# Altium schematic sheet PainRegister.SchDoc: Название платы
size 840 x 594 mm; ApprovedBy: Рогов; CheckedBy: Фамилия проверяющего; DrawnBy: Фамилия разработчика; DocumentNumber: Введите номер платы + Э3; SheetNumber: пусто если лист 1, иначе 1; SheetTotal: количество листов; Title1str: (вторая строка при необходимости); DocumentType: тип схемы; Format: A1; ImagePath: Введите номер платы
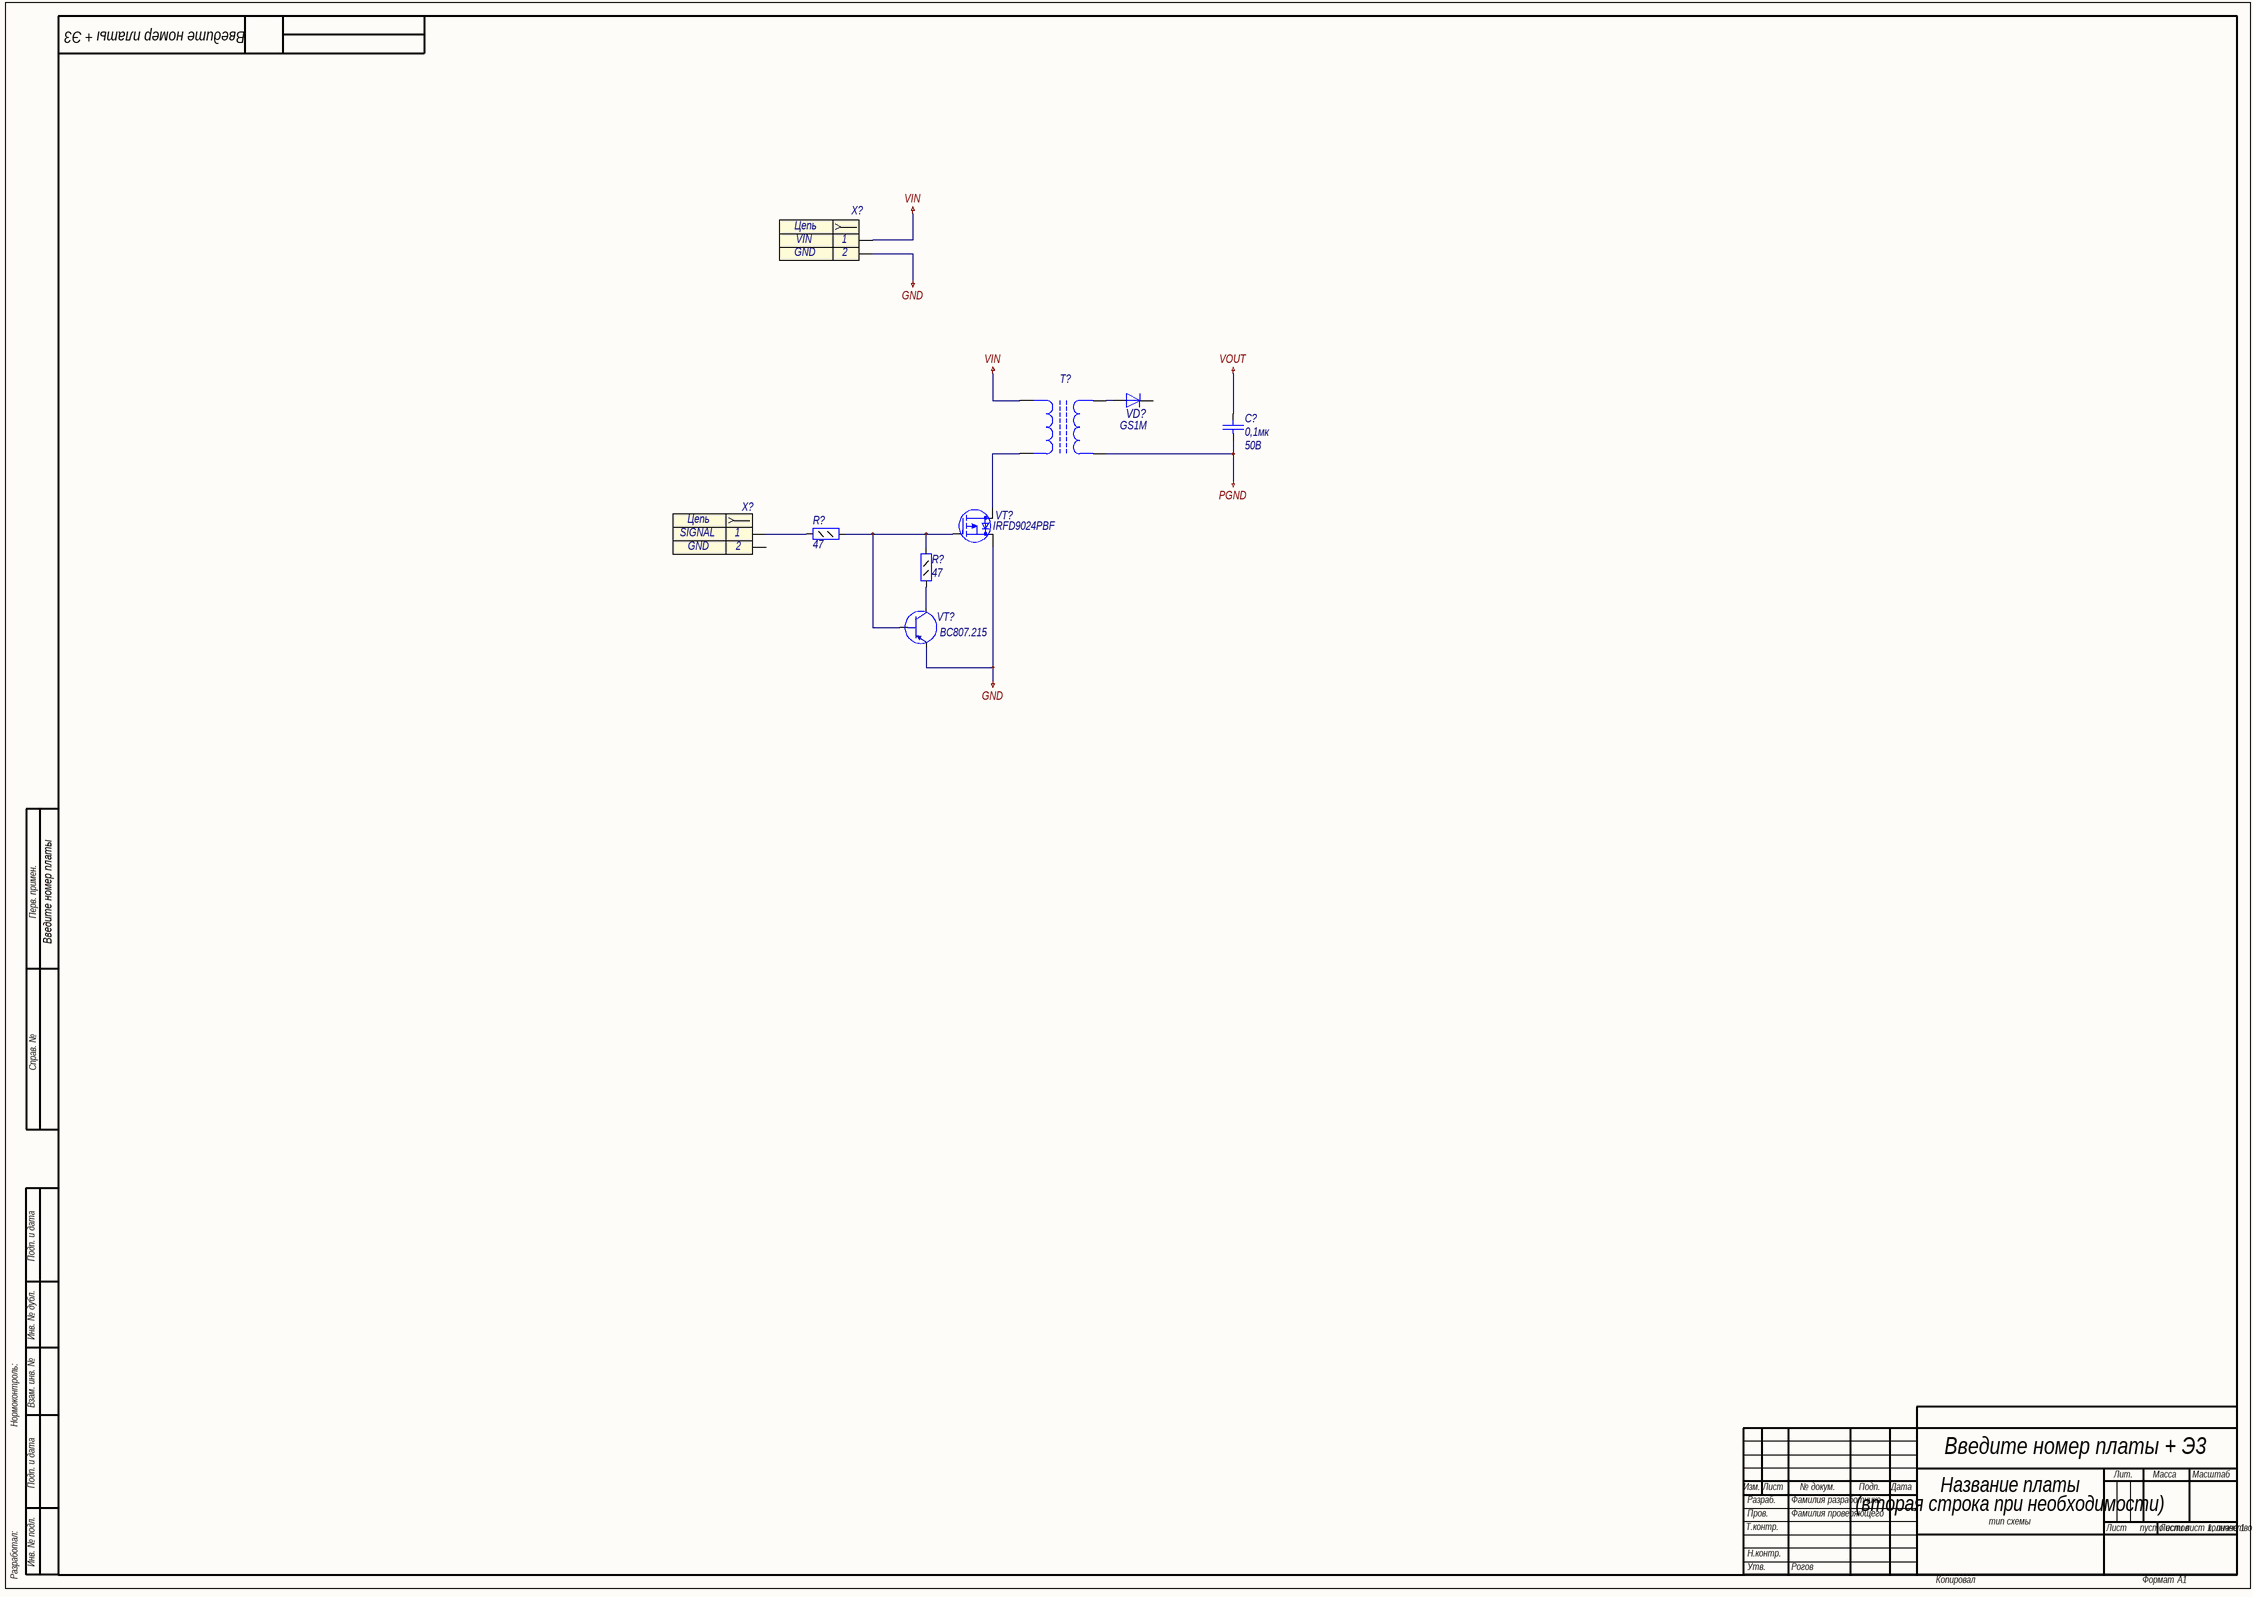
[diagram p0: PainRegister.SchDoc]

## Parts
(Parts that share a designator on the sheet are numbered #1, #2 ... from top to bottom, then left to right.)
C?  value 0,1мк  Voltage: 50B  [C0805]  (hidden comment: Capacitor)
R?#1  value 47  [R0805]  (hidden comment: Resistor_0,125Вт)
R?#2  value 47  [R0805]  (hidden comment: Resistor_0,125Вт)
T?  Transformer  (value not drawn)
VD?  Part Number: GS1M  [SMA]  (hidden comment: Diode)
VT?#1  Part Number: IRFD9024PBF  [HD-1]  (hidden comment: P-MOSFET)
VT?#2  Part Number: BC807.215  [SOT23-3]  (hidden comment: BJT PNP)
X?#1  Header_2_sct  [CWF-2R]  (value not drawn)
X?#2  Header_2_sct  [CWF-2R]  (value not drawn)

## Nets
GND: VT?#1.2(S) VT?#2.2 X?#1.2
PGND: C?.1 T?.4
VIN: T?.1 X?#1.1
VOUT: C?.2
NetR?#1_1: R?#1.1 X?#2.1
NetR?#1_2: R?#1.2 R?#2.2 VT?#1.1(G) VT?#2.1
NetR?#2_1: R?#2.1 VT?#2.3
NetT?_2: T?.2 VT?#1.3(D)
NetT?_3: T?.3 VD?.2(A)

Not connected (* = marked no-connect by the designer): VD? 1(K); X?#2 2

## Notes on the sheet
- Перв. примен.
- Справ. №
- Подп. и дата
- Инв. № дубл.
- Нормоконтроль:
- Взам. инв. №
- Изм.
- Лист
- № докум.
- Подп.
- Дата
- Лит.
- Масса
- Масштаб
- Т.контр.
- Пров.
- Разраб.
- Листов
- Разработал:
- Инв. № подл.
- Н.контр.
- Утв.
- Копировал
- Формат
- (in symbol DS1069-2 MR-A) Цепь

## Library data of the parts
C? = GRM21BR61E475KA12L: Конденсатор; Part Name: Capacitors; id: cap154; TKE: X5R; Part Number: GRM21BR61E475KA12L
R?#1 R?#2 = 1,2: Резистор; id: res3; Accuracy: 1%; Part Name: Resistor; Power: 0,125Вт
T? = Transformer: EMI Suppression Filter
VD? = GS1M: Диод; id: diode1; Backward Voltage: 1000B; Forward Voltage: 1,1B; Forward Current: 1A; Part Name: Diode
VT?#1 = IRFD9024PBF: N-MOSFET; Part Name: Transistor; id: trans1; Structure: p-channel; V drain-source max: (-60B); Rds: 0,28Ohm; Gate-to-source voltage: (+-)20B; Continuous drain current: 2,5A; Pulsed drain current: 20A; Power dissipation: 1,3W
VT?#2 = BC807.215: Part Name: Transistor; id: bjt1; hfe: 100; Vceo max: 45B; Ic max: 0,5A; Structure: pnp; Icpeak max: 0,5A
X?#1 = DS1069-2 MR-A: Разъем - 2 конт. розетка; Contact_1: VIN; Contact_2: GND; id: connect8; Part Number: DS1069-2 MR-A; Part Name: CWF-2R; Contact_3: Contact_3; Contact_4: Contact_4; Contact_5: Contact_5; Contact_6: Contact_6; Contact_7: Contact_7
X?#2 = DS1069-2 MR-A: Разъем - 2 конт. розетка; Contact_1: SIGNAL; Contact_2: GND; id: connect8; Part Number: DS1069-2 MR-A; Part Name: CWF-2R; Contact_3: Contact_3; Contact_4: Contact_4; Contact_5: Contact_5; Contact_6: Contact_6; Contact_7: Contact_7